# Altium schematic sheet PCB_CHECK_MAIN233-201219.SchDoc
size A2
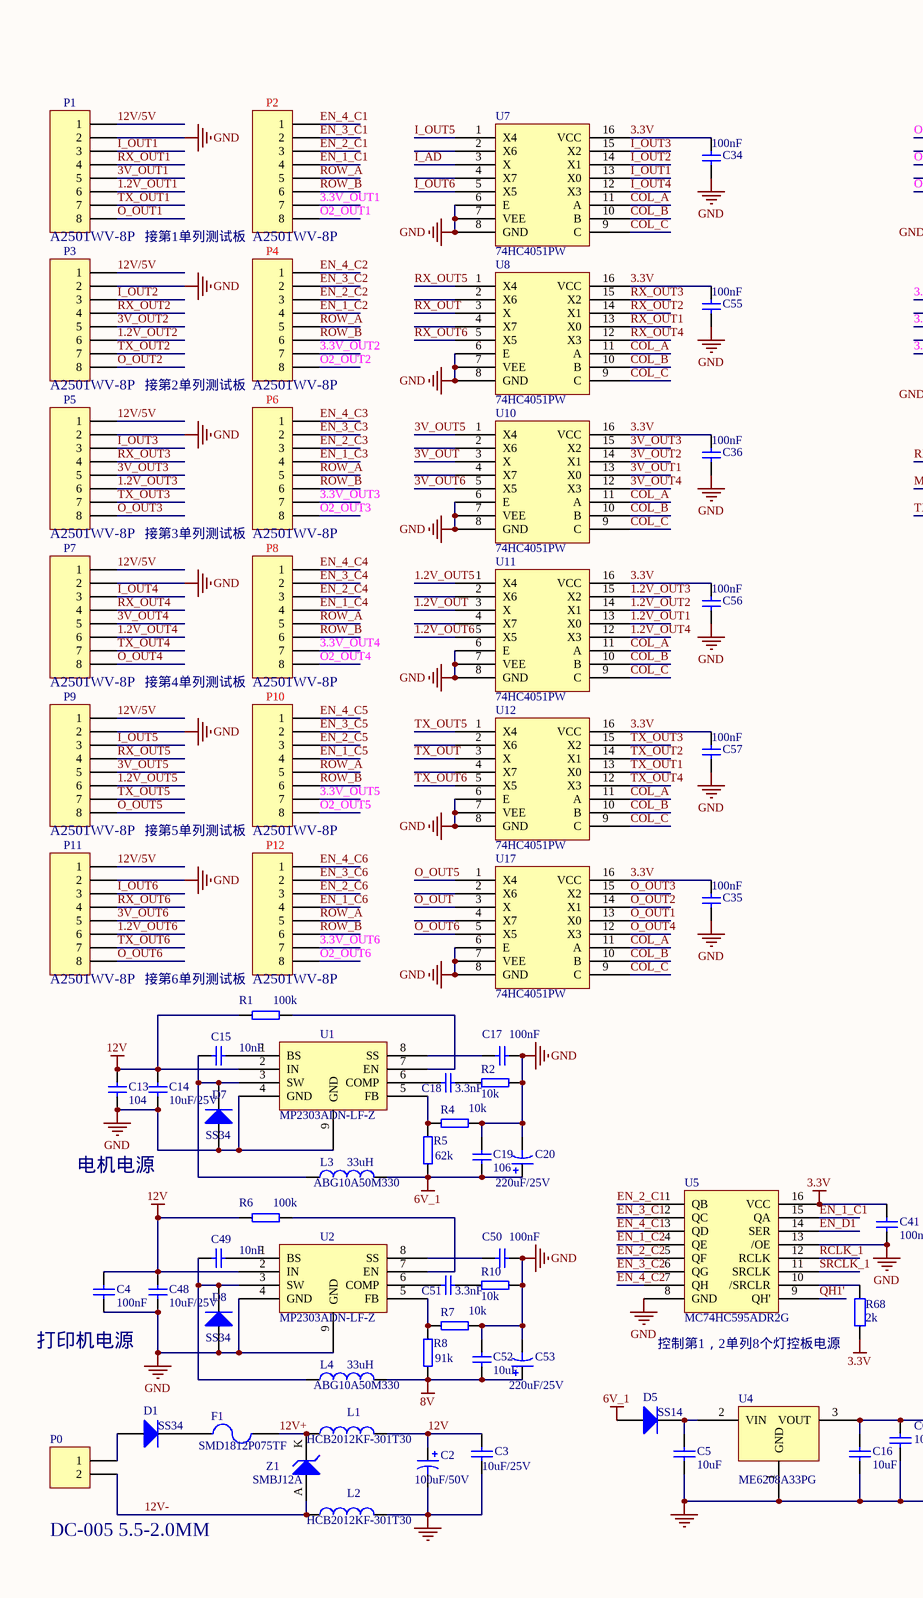
[diagram p0: PCB_CHECK_MAIN233-201219.SchDoc, left]
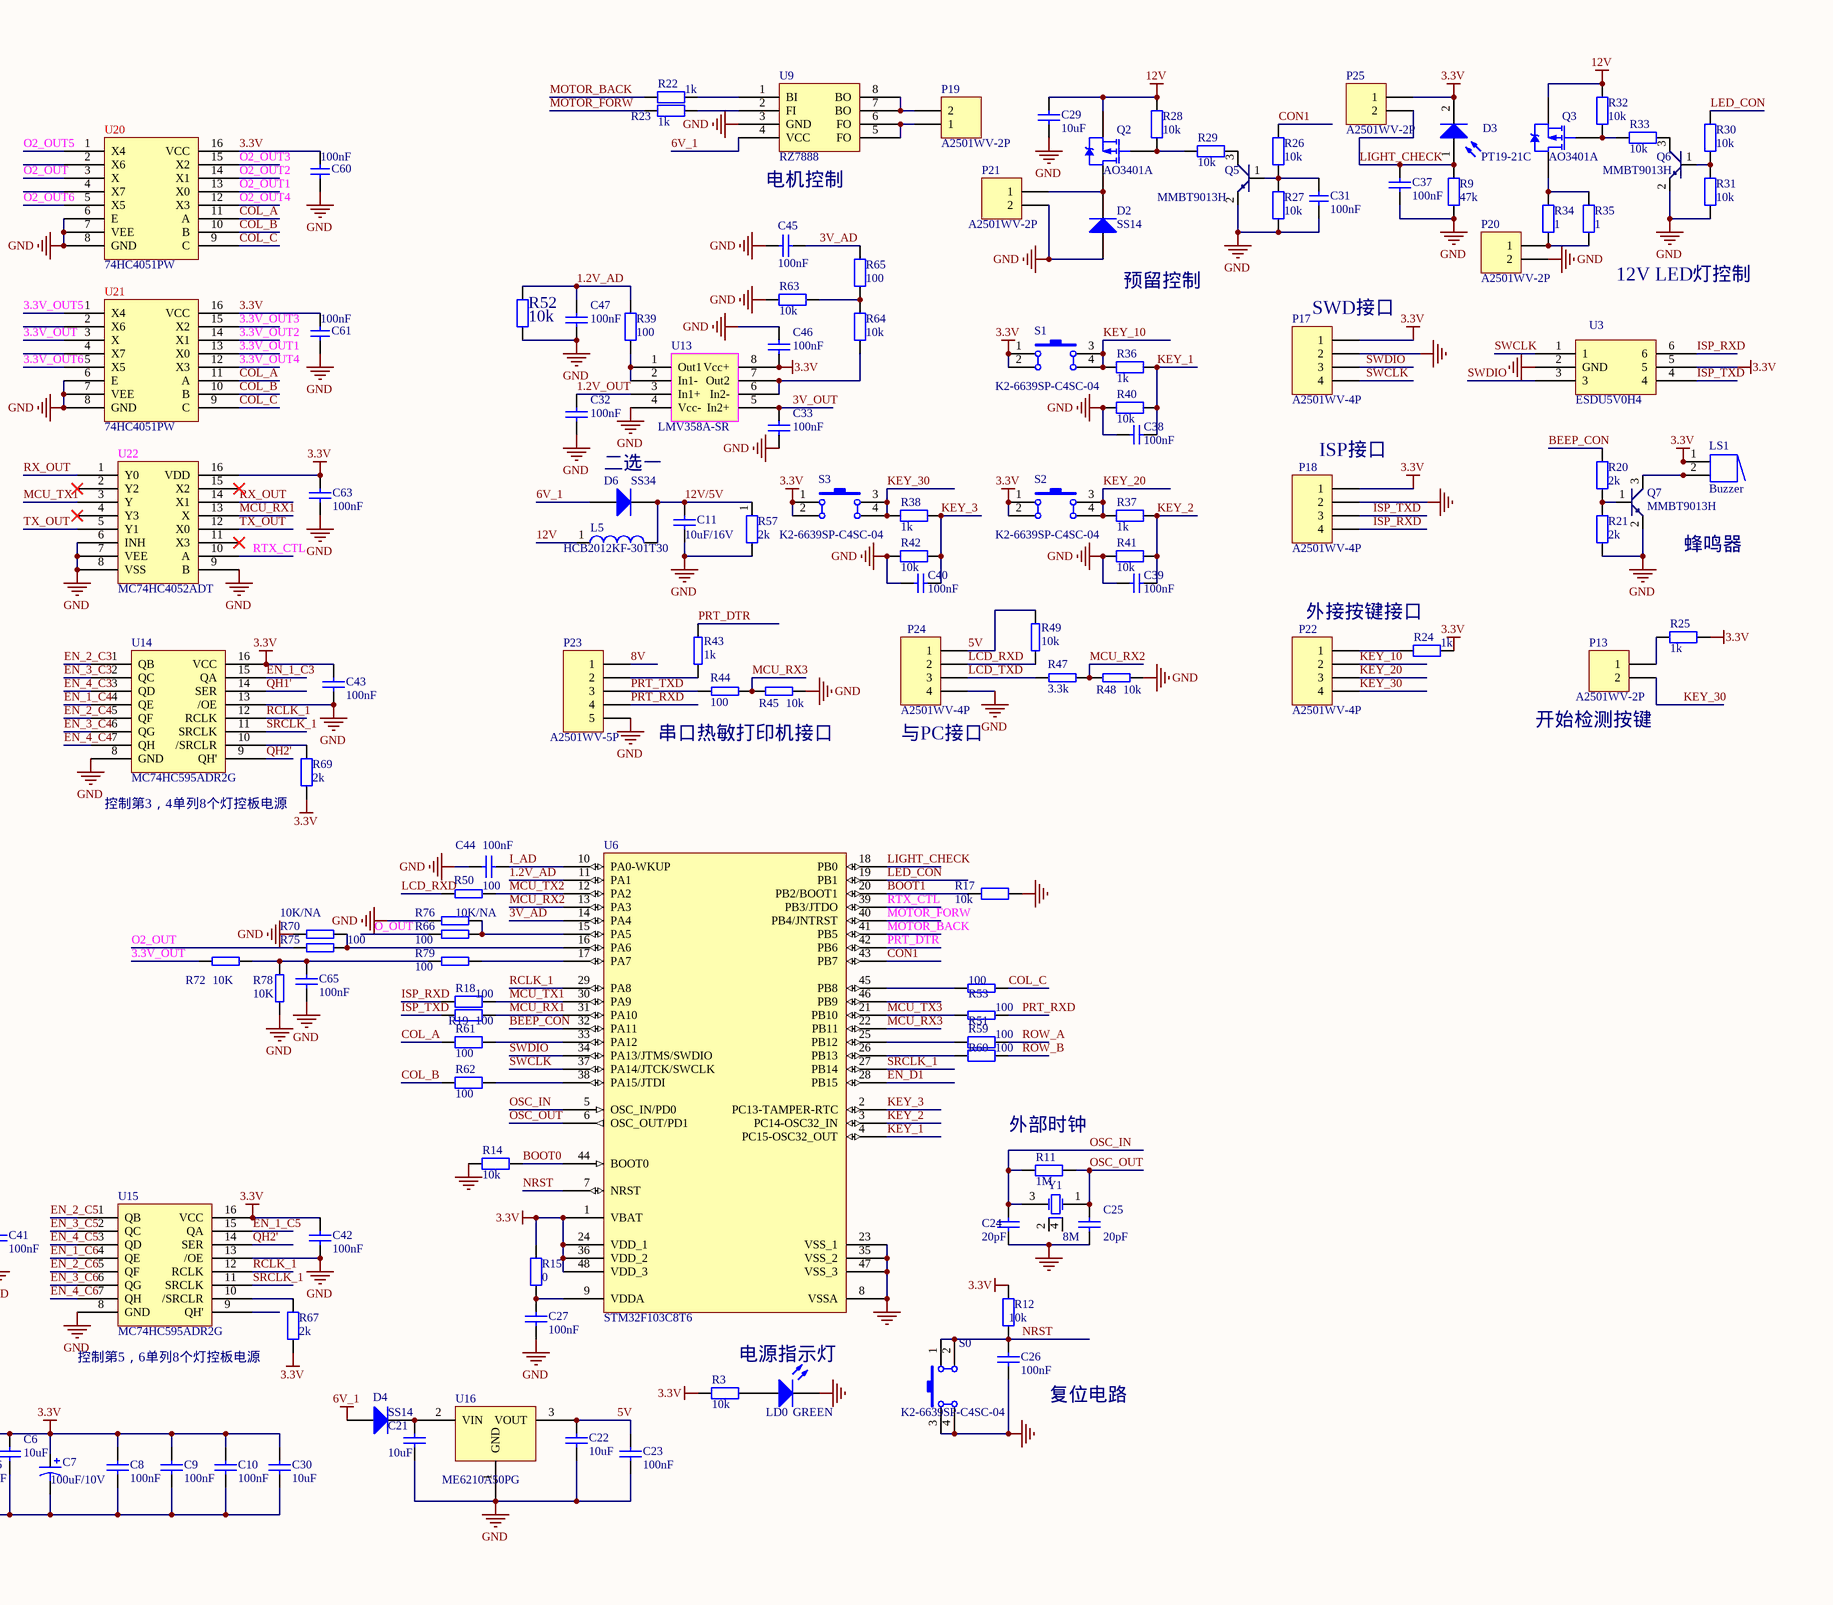
[diagram p1: PCB_CHECK_MAIN233-201219.SchDoc, right]

## Parts
C2  100uF/50V  [RB-6*9]
C3  10uF/25V  [C0805]
C4  100nF  [C0603]
C5  10uF  [C0603]
C6  10uF  [C0603]
C7  100uF/10V  [C3528]
C8  100nF  [C0603]
C9  100nF  [C0603]
C10  100nF  [C0603]
C11  10uF/16V  [C0603]
C13  104  [C0603]
C14  10uF/25V  [C0805]
C15  10nF  [C0603]
C16  10uF  [C0603]
C17  100nF  [C0603]
C18  3.3nF  [C0603]
C19  106  [C0603]
C20  220uF/25V  [RB-6*9]
C21  10uF  [C0603]
C22  10uF  [C0603]
C23  100nF  [C0603]
C24  20pF  [C0603]
C25  20pF  [C0603]
C26  100nF  [C0603]
C27  100nF  [C0603]
C29  10uF  [C0603]
C30  10uF  [C0603]
C31  100nF  [C0603]
C32  100nF  [C0603]
C33  100nF  [C0603]
C34  100nF  [C0603]
C35  100nF  [C0603]
C36  100nF  [C0603]
C37  100nF  [C0603]
C38  100nF  [C0603]
C39  100nF  [C0603]
C40  100nF  [C0603]
C41  100nF  [C0603]
C42  100nF  [C0603]
C43  100nF  [C0603]
C44  100nF  [C0603]
C45  100nF  [C0603]
C46  100nF  [C0603]
C47  100nF  [C0603]
C48  10uF/25V  [C0805]
C49  10nF  [C0603]
C50  100nF  [C0603]
C51  3.3nF  [C0603]
C52  10uF  [C0603]
C53  220uF/25V  [RB-6*9]
C55  100nF  [C0603]
C56  100nF  [C0603]
C57  100nF  [C0603]
C60  100nF  [C0603]
C61  100nF  [C0603]
C63  100nF  [C0603]
C65  100nF  [C0603]
D1  SS34  [SMB]
D2  SS14  [SOD-123F]
D3  PT19-21C  [LED-0603]
D4  SS14  [SOD-123F]
D5  SS14  [SOD-123F]
D6  SS34  [SMB]
D7  SS34  [SMB]
D8  SS34  [SMB]
F1  SMD1812P075TF  [1812]
L1  HCB2012KF-301T30  [R0805]
L2  HCB2012KF-301T30  [R0805]
L3  33uH  value ABG10A50M330  [L1040]
L4  33uH  value ABG10A50M330  [L1040]
L5  HCB2012KF-301T30  [R0805]
LD0  GREEN  [LED-0603]
LS1  Buzzer  [BUZZER-small]
P0  DC-005 5.5-2.0MM  [DC-005A]
P1  A2501WV-8P  [XH2.5-8P]
P2  A2501WV-8P  [XH2.5-8P]
P3  A2501WV-8P  [XH2.5-8P]
P4  A2501WV-8P  [XH2.5-8P]
P5  A2501WV-8P  [XH2.5-8P]
P6  A2501WV-8P  [XH2.5-8P]
P7  A2501WV-8P  [XH2.5-8P]
P8  A2501WV-8P  [XH2.5-8P]
P9  A2501WV-8P  [XH2.5-8P]
P10  A2501WV-8P  [XH2.5-8P]
P11  A2501WV-8P  [XH2.5-8P]
P12  A2501WV-8P  [XH2.5-8P]
P13  A2501WV-2P  [XH2.5-2P]
P17  A2501WV-4P  [XH2.5-4P]
P18  A2501WV-4P  [XH2.5-4P]
P19  A2501WV-2P  [XH2.5-2P]
P20  A2501WV-2P  [XH2.5-2P]
P21  A2501WV-2P  [XH2.5-2P]
P22  A2501WV-4P  [XH2.5-4P]
P23  A2501WV-5P  [XH2.5-5P]
P24  A2501WV-4P  [XH2.5-4P]
P25  A2501WV-2P  [XH2.5-2P]
Q2  AO3401A  [SOT-23]
Q3  AO3401A  [SOT-23]
Q5  MMBT9013H  [SOT-23]
Q6  MMBT9013H  [SOT-23]
Q7  MMBT9013H  [SOT-23]
R1  100k  [R0603]
R2  10k  [R0603]
R3  10k  [R0603]
R4  10k  [R0603]
R5  62k  [R0603]
R6  100k  [R0603]
R7  10k  [R0603]
R8  91k  [R0603]
R9  47k  [R0603]
R10  10k  [R0603]
R11  1M  [R0603]
R12  10k  [R0603]
R14  10k  [R0603]
R15  0  [R0603]
R17  10k  [R0603]
R18  100  [R0603]
R19  100  [R0603]
R20  2k  [R0603]
R21  2k  [R0603]
R22  1k  [R0603]
R23  1k  [R0603]
R24  1k  [R0603]
R25  1k  [R0603]
R26  10k  [R0603]
R27  10k  [R0603]
R28  10k  [R0603]
R29  10k  [R0603]
R30  10k  [R0603]
R31  10k  [R0603]
R32  10k  [R0603]
R33  10k  [R0603]
R34  1  [R1206]
R35  1  [R1206]
R36  1k  [R0603]
R37  1k  [R0603]
R38  1k  [R0603]
R39  100  [R0603]
R40  10k  [R0603]
R41  10k  [R0603]
R42  10k  [R0603]
R43  1k  [R0603]
R44  100  [R0603]
R45  10k  [R0603]
R47  3.3k  [R0603]
R48  10k  [R0603]
R49  10k  [R0603]
R50  100  [R0603]
R51  100  [R0603]
R52  10k  [R0603]
R53  100  [R0603]
R57  2k  [R0603]
R59  100  [R0603]
R60  100  [R0603]
R61  100  [R0603]
R62  100  [R0603]
R63  10k  [R0603]
R64  10k  [R0603]
R65  100  [R0603]
R66  100  [R0603]
R67  2k  [R0603]
R68  2k  [R0603]
R69  2k  [R0603]
R70  10K/NA  [R0603]
R72  10K  [R0603]
R75  100  [R0603]
R76  10K/NA  [R0603]
R78  10K  [R0603]
R79  100  [R0603]
S0  K2-6639SP-C4SC-04  [MY_KEYSOP4]
S1  K2-6639SP-C4SC-04  [MY_KEYSOP4]
S2  K2-6639SP-C4SC-04  [MY_KEYSOP4]
S3  K2-6639SP-C4SC-04  [MY_KEYSOP4]
U1  MP2303ADN-LF-Z  [SO-8-EP]
U2  MP2303ADN-LF-Z  [SO-8-EP]
U3  ESDU5V0H4  [SOT-23-6]
U4  ME6208A33PG  [SOT89N]
U5  MC74HC595ADR2G  [SOP16_M]
U6  STM32F103C8T6  [LQFP-48-1]
U7  74HC4051PW  [TSSOP16_N]
U8  74HC4051PW  [TSSOP16_N]
U9  RZ7888  [SO-8S]
U10  74HC4051PW  [TSSOP16_N]
U11  74HC4051PW  [TSSOP16_N]
U12  74HC4051PW  [TSSOP16_N]
U13  LMV358A-SR  [SO-8S]
U14  MC74HC595ADR2G  [SOP16_M]
U15  MC74HC595ADR2G  [SOP16_M]
U16  ME6210A50PG  [SOT89N]
U17  74HC4051PW  [TSSOP16_N]
U20  74HC4051PW  [TSSOP16_N]
U21  74HC4051PW  [TSSOP16_N]
U22  MC74HC4052ADT  [TSSOP16_N]
Y1  8M  [CRYSTAL_3.2*2.5]
Z1  SMBJ12A  [SMB]

## Nets
3.3V: C6.1 C7.1 C8.1 C9.1 C10.1 C16.1 C30.1 C34.1 C35.1 C36.1 C41.1 C42.1 C43.1 C46.1 C55.1 C56.1 C57.1 C60.1 C61.1 C63.2 D3.2(K) LS1.1 P17.1 P18.1 P25.1 R3.1 R12.2 R15.2 R24.1 R25.1 R67.1 R68.1 R69.1 S1.1 S1.2 S2.1 S2.2 S3.1 S3.2 U3.5 U4.3(VOUT) U5.16(VCC) U6.1(VBAT) U6.24(VDD_1) U6.36(VDD_2) U6.48(VDD_3) U7.16(VCC) U8.16(VCC) U10.16(VCC) U11.16(VCC) U12.16(VCC) U13.8(Vcc+) U14.16(VCC) U15.16(VCC) U17.16(VCC) U20.16(VCC) U21.16(VCC) U22.16(VDD)
6V_1: C19.1 C20.1 D4.1(A) D5.1(A) D6.1(A) L3.2 R5.2 U9.4(VCC)
8V: C52.1 C53.1 L4.2 P23.1 R8.2
12V: C2.1 C3.1 C4.1 C13.2 C14.1 C29.1 C48.1 L1.1 L5.1 Q2.2(S) Q3.2(S) R1.2 R6.2 R28.2 R32.2 U1.2(IN) U2.2(IN)
GND: C2.2 C3.2 C4.2 C5.2 C6.2 C7.2 C8.2 C9.2 C10.2 C11.2 C13.1 C14.2 C16.2 C17.2 C19.2 C20.2 C21.2 C22.2 C23.1 C24.2 C25.2 C26.2 C27.2 C29.2 C30.2 C31.2 C32.1 C33.1 C34.2 C35.2 C36.2 C37.2 C38.1 C39.1 C40.1 C41.2 C42.2 C43.2 C44.1 C45.2 C46.2 C47.1 C48.2 C50.2 C52.2 C53.2 C55.2 C56.2 C57.2 C60.2 C61.2 C63.1 C65.1 D2.1(A) D7.1(A) D8.1(A) L2.1 LD0.2(K) P1.2 P3.2 P5.2 P7.2 P9.2 P11.2 P17.2 P18.2 P20.2 P21.2 P23.5 P24.4 Q5.2(E) Q6.2(E) Q7.2(E) R2.1 R4.1 R7.1 R9.2 R10.1 R14.1 R17.1 R21.1 R27.1 R31.1 R40.2 R41.2 R42.2 R45.1 R48.1 R52.2 R57.2 R63.2 R70.1 R76.2 R78.1 S0.3 S0.4 U1.4(GND) U1.9(GND) U2.4(GND) U2.9(GND) U3.2(GND) U4.1(GND) U5.8(GND) U5.13(/OE) U6.8(VSSA) U6.23(VSS_1) U6.35(VSS_2) U6.47(VSS_3) U7.6(E) U7.7(VEE) U7.8(GND) U8.6(E) U8.7(VEE) U8.8(GND) U9.3(GND) U10.6(E) U10.7(VEE) U10.8(GND) U11.6(E) U11.7(VEE) U11.8(GND) U12.6(E) U12.7(VEE) U12.8(GND) U13.4(Vcc-) U14.8(GND) U14.13(/OE) U15.8(GND) U15.13(/OE) U16.1(GND) U17.6(E) U17.7(VEE) U17.8(GND) U20.6(E) U20.7(VEE) U20.8(GND) U21.6(E) U21.7(VEE) U21.8(GND) U22.6(INH) U22.7(VEE) U22.8(VSS) U22.9(B)
1.2V_AD: C47.2 R39.1 R52.1 U6.11(PA1)
1.2V_OUT: C32.2 U11.3(X) U13.3(In1+)
1.2V_OUT1: P1.6 U11.13(X0)
1.2V_OUT2: P3.6 U11.14(X1)
1.2V_OUT3: P5.6 U11.15(X2)
1.2V_OUT4: P7.6 U11.12(X3)
1.2V_OUT5: P9.6 U11.1(X4)
1.2V_OUT6: P11.6 U11.5(X5)
3.3V_OUT: R72.1 U21.3(X)
3.3V_OUT1: P2.7 U21.13(X0)
3.3V_OUT2: P4.7 U21.14(X1)
3.3V_OUT3: P6.7 U21.15(X2)
3.3V_OUT4: P8.7 U21.12(X3)
3.3V_OUT5: P10.7 U21.1(X4)
3.3V_OUT6: P12.7 U21.5(X5)
3V_AD: C45.1 R65.1 U6.14(PA4)
3V_OUT: C33.2 U10.3(X) U13.5(In2+)
3V_OUT1: P1.5 U10.13(X0)
3V_OUT2: P3.5 U10.14(X1)
3V_OUT3: P5.5 U10.15(X2)
3V_OUT4: P7.5 U10.12(X3)
3V_OUT5: P9.5 U10.1(X4)
3V_OUT6: P11.5 U10.5(X5)
5V: C22.1 C23.2 P24.1 R49.2 U16.3(VOUT)
12V+: F1.2 L1.2 Z1.K
12V-: L2.2 P0.2 Z1.A
12V/5V: C11.1 D6.2(K) L5.2 P1.1 P3.1 P5.1 P7.1 P9.1 P11.1 R57.1
BEEP_CON: R20.1 U6.32(PA11)
BOOT0: R14.2 U6.44(BOOT0)
BOOT1: R17.2 U6.20(PB2/BOOT1)
COL_A: R61.1 U7.11(A) U8.11(A) U10.11(A) U11.11(A) U12.11(A) U17.11(A) U20.11(A) U21.11(A)
COL_B: R62.1 U7.10(B) U8.10(B) U10.10(B) U11.10(B) U12.10(B) U17.10(B) U20.10(B) U21.10(B)
COL_C: R53.1 U7.9(C) U8.9(C) U10.9(C) U11.9(C) U12.9(C) U17.9(C) U20.9(C) U21.9(C)
CON1: R26.1 U6.43(PB7)
EN_1_C1: P2.4 U5.15(QA)
EN_1_C2: P4.4 U5.4(QE)
EN_1_C3: P6.4 U14.15(QA)
EN_1_C4: P8.4 U14.4(QE)
EN_1_C5: P10.4 U15.15(QA)
EN_1_C6: P12.4 U15.4(QE)
EN_2_C1: P2.3 U5.1(QB)
EN_2_C2: P4.3 U5.5(QF)
EN_2_C3: P6.3 U14.1(QB)
EN_2_C4: P8.3 U14.5(QF)
EN_2_C5: P10.3 U15.1(QB)
EN_2_C6: P12.3 U15.5(QF)
EN_3_C1: P2.2 U5.2(QC)
EN_3_C2: P4.2 U5.6(QG)
EN_3_C3: P6.2 U14.2(QC)
EN_3_C4: P8.2 U14.6(QG)
EN_3_C5: P10.2 U15.2(QC)
EN_3_C6: P12.2 U15.6(QG)
EN_4_C1: P2.1 U5.3(QD)
EN_4_C2: P4.1 U5.7(QH)
EN_4_C3: P6.1 U14.3(QD)
EN_4_C4: P8.1 U14.7(QH)
EN_4_C5: P10.1 U15.3(QD)
EN_4_C6: P12.1 U15.7(QH)
EN_D1: U5.14(SER) U6.28(PB15)
I_AD: C44.2 U6.10(PA0-WKUP) U7.3(X)
I_OUT1: P1.3 U7.13(X0)
I_OUT2: P3.3 U7.14(X1)
I_OUT3: P5.3 U7.15(X2)
I_OUT4: P7.3 U7.12(X3)
I_OUT5: P9.3 U7.1(X4)
I_OUT6: P11.3 U7.5(X5)
ISP_RXD: P18.4 R18.1 U3.6
ISP_TXD: P18.3 R19.1 U3.4
KEY_1: C38.2 R36.1 R40.1 U6.4(PC15-OSC32_OUT)
KEY_2: C39.2 R37.1 R41.1 U6.3(PC14-OSC32_IN)
KEY_3: C40.2 R38.1 R42.1 U6.2(PC13-TAMPER-RTC)
KEY_10: P22.2 R36.2 S1.3 S1.4
KEY_20: P22.3 R37.2 S2.3 S2.4
KEY_30: P13.2 P22.4 R38.2 S3.3 S3.4
LCD_RXD: P24.2 R49.1 R50.1
LCD_TXD: P24.3 R47.1
LED_CON: R30.1 U6.19(PB1)
LIGHT_CHECK: C37.1 D3.1(A) P25.2 R9.1 U6.18(PB0)
MCU_RX1: R19.2 U6.31(PA10) U22.13(X)
MCU_RX2: R47.2 R48.2 U6.13(PA3)
MCU_RX3: R44.2 R45.2 U6.22(PB11)
MCU_TX1: R18.2 U6.30(PA9) U22.3(Y)
MCU_TX2: R50.2 U6.12(PA2)
MCU_TX3: R51.2 U6.21(PB10)
MOTOR_BACK: R22.1 U6.41(PB5)
MOTOR_FORW: R23.2 U6.40(PB4/JNTRST)
NRST: C26.1 R12.1 S0.1 S0.2 U6.7(NRST)
O2_OUT: R75.1 U20.3(X)
O2_OUT1: P2.8 U20.13(X0)
O2_OUT2: P4.8 U20.14(X1)
O2_OUT3: P6.8 U20.15(X2)
O2_OUT4: P8.8 U20.12(X3)
O2_OUT5: P10.8 U20.1(X4)
O2_OUT6: P12.8 U20.5(X5)
O_OUT: R66.1 U17.3(X)
O_OUT1: P1.8 U17.13(X0)
O_OUT2: P3.8 U17.14(X1)
O_OUT3: P5.8 U17.15(X2)
O_OUT4: P7.8 U17.12(X3)
O_OUT5: P9.8 U17.1(X4)
O_OUT6: P11.8 U17.5(X5)
OSC_IN: C24.1 R11.1 U6.5(OSC_IN/PD0) Y1.3(OUTPUT)
OSC_OUT: C25.1 R11.2 U6.6(OSC_OUT/PD1) Y1.1(INPUT)
PRT_DTR: R43.2 U6.42(PB6)
PRT_RXD: P23.4 R51.1
PRT_TXD: P23.3 R44.1
QH1': U5.9(QH') U14.14(SER)
QH2': U14.9(QH') U15.14(SER)
RCLK_1: U5.12(RCLK) U6.29(PA8) U14.12(RCLK) U15.12(RCLK)
ROW_A: P2.5 P4.5 P6.5 P8.5 P10.5 P12.5 R59.1
ROW_B: P2.6 P4.6 P6.6 P8.6 P10.6 P12.6 R60.1
RTX_CTL: U6.39(PB3/JTDO) U22.10(A)
RX_OUT: U8.3(X) U22.1(Y0) U22.14(X1)
RX_OUT1: P1.4 U8.13(X0)
RX_OUT2: P3.4 U8.14(X1)
RX_OUT3: P5.4 U8.15(X2)
RX_OUT4: P7.4 U8.12(X3)
RX_OUT5: P9.4 U8.1(X4)
RX_OUT6: P11.4 U8.5(X5)
SRCLK_1: U5.11(SRCLK) U6.27(PB14) U14.11(SRCLK) U15.11(SRCLK)
SWCLK: P17.4 U3.1 U6.37(PA14/JTCK/SWCLK)
SWDIO: P17.3 U3.3 U6.34(PA13/JTMS/SWDIO)
TX_OUT: U12.3(X) U22.5(Y1) U22.12(X0)
TX_OUT1: P1.7 U12.13(X0)
TX_OUT2: P3.7 U12.14(X1)
TX_OUT3: P5.7 U12.15(X2)
TX_OUT4: P7.7 U12.12(X3)
TX_OUT5: P9.7 U12.1(X4)
TX_OUT6: P11.7 U12.5(X5)
NetC5_1: C5.1 D5.2(K) U4.2(VIN)
NetC15_1: C15.1 D7.2(K) L3.1 U1.3(SW)
NetC15_2: C15.2 U1.1(BS)
NetC17_1: C17.1 U1.8(SS)
NetC18_1: C18.1 U1.6(COMP)
NetC18_2: C18.2 R2.2
NetC21_1: C21.1 D4.2(K) U16.2(VIN)
NetC27_1: C27.1 R15.1 U6.9(VDDA)
NetC31_1: C31.1 Q5.1(B) R26.2 R27.2
NetC49_1: C49.1 D8.2(K) L4.1 U2.3(SW)
NetC49_2: C49.2 U2.1(BS)
NetC50_1: C50.1 U2.8(SS)
NetC51_1: C51.1 U2.6(COMP)
NetC51_2: C51.2 R10.2
NetC65_2: C65.2 R72.2 R78.2 R79.1
NetD1_1: D1.1(A) P0.1
NetD1_2: D1.2(K) F1.1
NetD2_2: D2.2(K) P21.1 Q2.3(D)
NetLD0_1: LD0.1(A) R3.2
NetLS1_2: LS1.2 Q7.3(C)
NetP13_1: P13.1 R25.2
NetP19_1: P19.1 U9.5(FO) U9.6(FO)
NetP19_2: P19.2 U9.7(BO) U9.8(BO)
NetP20_1: P20.1 R34.1 R35.1
NetP22_1: P22.1 R24.2
NetP23_2: P23.2 R43.1
NetQ2_1: Q2.1(G) R28.1 R29.2
NetQ3_1: Q3.1(G) R32.1 R33.2
NetQ3_3: Q3.3(D) R34.2 R35.2
NetQ5_3: Q5.3(C) R29.1
NetQ6_1: Q6.1(B) R30.2 R31.2
NetQ6_3: Q6.3(C) R33.1
NetQ7_1: Q7.1(B) R20.2 R21.2
NetR1_1: R1.1 U1.7(EN)
NetR4_2: R4.2 R5.1 U1.5(FB)
NetR6_1: R6.1 U2.7(EN)
NetR7_2: R7.2 R8.1 U2.5(FB)
NetR22_2: R22.2 U9.1(BI)
NetR23_1: R23.1 U9.2(FI)
NetR39_2: R39.2 U13.1(Out1) U13.2(In1-)
NetR53_2: R53.2 U6.45(PB8)
NetR59_2: R59.2 U6.25(PB12)
NetR60_2: R60.2 U6.26(PB13)
NetR61_2: R61.2 U6.33(PA12)
NetR62_2: R62.2 U6.38(PA15/JTDI)
NetR63_1: R63.1 R64.2 R65.2
NetR64_1: R64.1 U13.6(In2-) U13.7(Out2)
NetR66_2: R66.2 R76.1 U6.15(PA5)
NetR67_2: R67.2 U15.10(/SRCLR)
NetR68_2: R68.2 U5.10(/SRCLR)
NetR69_2: R69.2 U14.10(/SRCLR)
NetR70_2: R70.2 R75.2 U6.16(PA6)
NetR79_2: R79.2 U6.17(PA7)

Not connected (* = marked no-connect by the designer): U6 46(PB9); U7 2(X6) 4(X7); U8 2(X6) 4(X7); U10 2(X6) 4(X7); U11 2(X6) 4(X7); U12 2(X6) 4(X7); U15 9(QH'); U17 2(X6) 4(X7); U20 2(X6) 4(X7); U21 2(X6) 4(X7); U22 2(Y2)* 4(Y3)* 11(X3)* 15(X2)*; Y1 2(GROUND) 4(GROUND)

## Notes on the sheet
- (near U9) 电机控制
- 接第1单列测试板
- (near D2) 预留控制
- (near P17) SWD接口
- 12V LED灯控制
- 接第2单列测试板
- (near P18) ISP接口
- 二选一
- 接第3单列测试板
- 蜂鸣器
- (near P22) 外接按键接口
- 接第4单列测试板
- (near P13) 开始检测按键
- 串口热敏打印机接口
- (near P24) 与PC接口
- 接第5单列测试板
- (near U14) 控制第3，4单列8个灯控板电源
- 接第6单列测试板
- (near R11) 外部时钟
- 电机电源
- (near C4) 打印机电源
- (near U5) 控制第1，2单列8个灯控板电源
- (near U15) 控制第5，6单列8个灯控板电源
- 电源指示灯
- (near C26) 复位电路

## Library data of the parts
C2 C7 = Cap Pol1: Polarized Capacitor (Radial); Published: 8-Jun-2000; LatestRevisionDate: 17-Jul-2002; LatestRevisionNote: Re-released for DXP Platform.; PackageReference: RB7.6-15; Publisher: Altium Limited; PackageDescription: Polarized Capacitor (Radial); 2 Leads
  C2: Value: 100uF/50V
  C7: Value: 100uF/10V
C3-C6 C8-C11 C16 C21-C27 C29 C30 C32 C33 C37 C41-C47 C63 C65 = Cap: Capacitor; Published: 8-Jun-2000; LatestRevisionDate: 17-Jul-2002; LatestRevisionNote: Re-released for DXP Platform.; PackageReference: RAD-0.3; Publisher: Altium Limited; PackageDescription: Radial Cap, Thru-Hole; 2 Leads; 0.3 in Pin Spacing
  C3: Value: 10uF/25V
  C4 C8-C10 C23 C26 C27 C32 C33 C37 C41-C47 C63 C65: Value: 100nF
  C5 C6 C16 C21 C22 C29 C30: Value: 10uF
  C11: Value: 10uF/16V
  C24 C25: Value: 20pF
C13-C15 C17-C19 C31 C34-C36 C38-C40 C48-C52 C55-C57 C60 C61 = Capacitor: 电容器; 型号及规格: 0805-104K  (50V0.1μF±10%); 名称: 多层片状陶瓷电容; 封装: 0805; 供应商: 平尚科技
C20 C53 = Cap Pol1: Polarized Capacitor (Radial); Value: 820uF/6.3V; Published: 8-Jun-2000; LatestRevisionDate: 17-Jul-2002; LatestRevisionNote: Re-released for DXP Platform.; PackageReference: RB7.6-15; Publisher: Altium Limited; PackageDescription: Polarized Capacitor (Radial); 2 Leads
D1 D4-D6 = Diode 1N4001: 1 Amp General Purpose Rectifier; Published: 8-Jun-2000; LatestRevisionDate: 17-Jul-2002; LatestRevisionNote: Re-released for DXP Platform.; DatasheetVersion: 1998; PackageVersion: Aug-1999; PackageReference: DO-41; Publisher: Altium Limited; PackageDescription: Diode, Axial; Body 5.2 x 2.7 mm (LxDia. max), Lead Dia. 0.86 mm (max); Code_JEDEC: DO-204-AL; ComponentLink1Description: Manufacturer Link; ComponentLink1URL: http://www.fairchildsemi.com/; ComponentLink2Description: Datasheet; ComponentLink2URL: http://www.fairchildsemi.com/ds/1N%2F1N4001.pdf
  D1 D6: Value: SS34
  D4 D5: Value: SS14
D2 D7 D8 = Diode: 通用二极管; Published: 8-Jun-2000; LatestRevisionDate: 17-Jul-2002; LatestRevisionNote: Re-released for DXP Platform.; PackageVersion: Sep-1996; PackageReference: SMC; Publisher: Altium Limited; PackageDescription: DO-214-AB/SMC; 2 C-Bend Leads; Body 7.9 x 5.9 mm, inc. leads (LxW); Code_JEDEC: DO-214-AB
D3 = Photo Sen: Photosensitive Diode; Published: 24-Mar-1999; LatestRevisionDate: 17-Jul-2002; LatestRevisionNote: Re-released for DXP Platform.; PackageReference: PIN2; Publisher: Altium Limited; Value: PT19-21C
F1 = Fuse 2: Fuse; Published: 8-Jun-2000; LatestRevisionDate: 17-Jul-2002; LatestRevisionNote: Re-released for DXP Platform.; PackageReference: PIN-W2/E2.8; Publisher: Altium Limited; PackageDescription: Thru-Hole; 2 Leads
L1-L5 = Inductor: Code_IEC: 1005; Published: 8-Jun-2000; LatestRevisionDate: 29-May-2009; LatestRevisionNote: IPC-7351 Footprint Added.; PackageReference: 0402-A; Publisher: Altium Limited; PackageDescription: Chip Inductor; Code_JEITA: 0402
  L1 L2 L5: Value: HCB2012KF-301T30
LD0 = LED0: LED灯; Published: 8-Jun-2000; LatestRevisionDate: 08-Jul-2005; LatestRevisionNote: Mech Layer 1 removed.; PackageReference: LED-0; Publisher: Altium Limited; Value: GREEN
LS1 = Buzzer: Magnetic Transducer Buzzer; Published: 24-Mar-1999; LatestRevisionDate: 17-Dec-2003; LatestRevisionNote: Schematic revised, PCB Footprint replaced.; DatasheetVersion: 17-Dec-2003; PackageReference: ABSM-1574; Publisher: Altium Limited; PackageDescription: Magnetic Transducer Buzzer; ComponentLink1Description: Manufacturer Link; ComponentLink1URL: http://www.megastar.com/linecard/buzzmode/index.php
P0 P13 P19-P21 P25 = Header 2: Header, 2-Pin; LatestRevisionDate: 17-Jul-2002; LatestRevisionNote: Re-released for DXP Platform.; Publisher: Altium Limited
P1-P12 = Header 8: Header, 8-Pin; LatestRevisionDate: 17-Jul-2002; LatestRevisionNote: Re-released for DXP Platform.; Publisher: Altium Limited
P17 P18 P22 P24 = Header 4: Header, 4-Pin; LatestRevisionDate: 17-Jul-2002; LatestRevisionNote: Re-released for DXP Platform.; Publisher: Altium Limited
P23 = Header 5: Header, 5-Pin; LatestRevisionDate: 17-Jul-2002; LatestRevisionNote: Re-released for DXP Platform.; Publisher: Altium Limited
Q2 Q3 = MY_MOSFET-P: P-Channel MOSFET; PackageDocument: 1995/1996; Published: 8-Jun-2000; LatestRevisionDate: 17-Jul-2002; LatestRevisionNote: Re-released for DXP Platform.; PackageReference: E3; Publisher: Altium Limited
Q5-Q7 = MY_NPN: 8050/BCW846/BCW847
R1 R2 R4-R8 R10 R43-R45 R47-R51 R53 R66 R70 R72 R75 R76 R78 R79 = Resistance: 电阻器; 型号及规格: 0805-000J(0kΩ±5%); 名称: 厚膜片式固定电阻; 封装: 0805; 供应商: 平尚科技
R3 R9 R11 R12 R14 R15 R17-R42 R52 R57 R59-R65 R67-R69 = Res2: Resistor; Published: 8-Jun-2000; LatestRevisionDate: 17-Jul-2002; LatestRevisionNote: Re-released for DXP Platform.; PackageReference: AXIAL-0.4; Publisher: Altium Limited
  R3 R12 R14 R17 R40-R42 R52 R63 R64: PackageDescription: Axial Device, Thru-Hole; 2 Leads; 0.4 in Pin Spacing; Value: 10k
  R9: PackageDescription: Axial Device, Thru-Hole; 2 Leads; 0.4 in Pin Spacing; Value: 47k
  R11: PackageDescription: Axial Device, Thru-Hole; 2 Leads; 0.4 in Pin Spacing; Value: 1M
  R15: PackageDescription: Axial Device, Thru-Hole; 2 Leads; 0.4 in Pin Spacing; Value: 0
  R18 R19 R39 R59-R62 R65: PackageDescription: Axial Device, Thru-Hole; 2 Leads; 0.4 in Pin Spacing; Value: 100
  R20 R21: Value: 2k
  R22 R23: Value: 1k
  R24 R25 R36-R38: PackageDescription: Axial Device, Thru-Hole; 2 Leads; 0.4 in Pin Spacing; Value: 1k
  R26-R33: Value: 10k
  R34 R35: Value: 1
  R57 R67-R69: PackageDescription: Axial Device, Thru-Hole; 2 Leads; 0.4 in Pin Spacing; Value: 2k
S0-S3 = SW-PB-4pin: Switch; Published: 24-Mar-1999; LatestRevisionDate: 17-Jul-2002; LatestRevisionNote: Re-released for DXP Platform.; PackageReference: SPST-2; Publisher: Altium Limited
  S1-S3: Value: K2-6639SP-C4SC-04
U1 U2 = TD1519A
U3 = CESDLC5V0M5
U4 U16 = ME6208A50PG
U5 U14 U15 = 74HC595: Value: MC74HC595ADR2G
U6 = STM32F103C8T6: STM32 ARM-based 32-bit MCU with 64 Kbytes Flash, 48-pin LQFP, Industrial Temperature; Published: 30-May-2008; DatasheetVersion: rev6, Mar-2008; PackageVersion: Mar-2008; PackageReference: LQFP48; Publisher: Altium Limited; PackageDescription: 48-Pin Low-Profile Quad Flat Pack, 7 x 7 mm Body, 0.5 mm Pitch (LQFP48); ComponentLink1Description: Manufacturer Link; ComponentLink1URL: www.st.com/stm32; ComponentLink2Description: Datasheet; ComponentLink2URL: http://www.st.com/stonline/products/literature/ds/13587.pdf
U7 U8 U10-U12 U17 U20 U21 = CD4051
U13 = LM358: dual-op; Value: LMV358A-SR
U22 = CD4052
Y1 = CRYSTAL-PASSIVE_3225
Z1 = D Zener: Zener Diode; Published: 8-Jun-2000; LatestRevisionDate: 17-Jul-2002; LatestRevisionNote: Re-released for DXP Platform.; PackageReference: DIODE-0.7; Publisher: Altium Limited; PackageDescription: Diode, Thru-Hole; 2 Leads; 0.7 in Pin Spacing